# EAGLE design PCB Terminal Block & Connector (EAGLE 9.6.2)
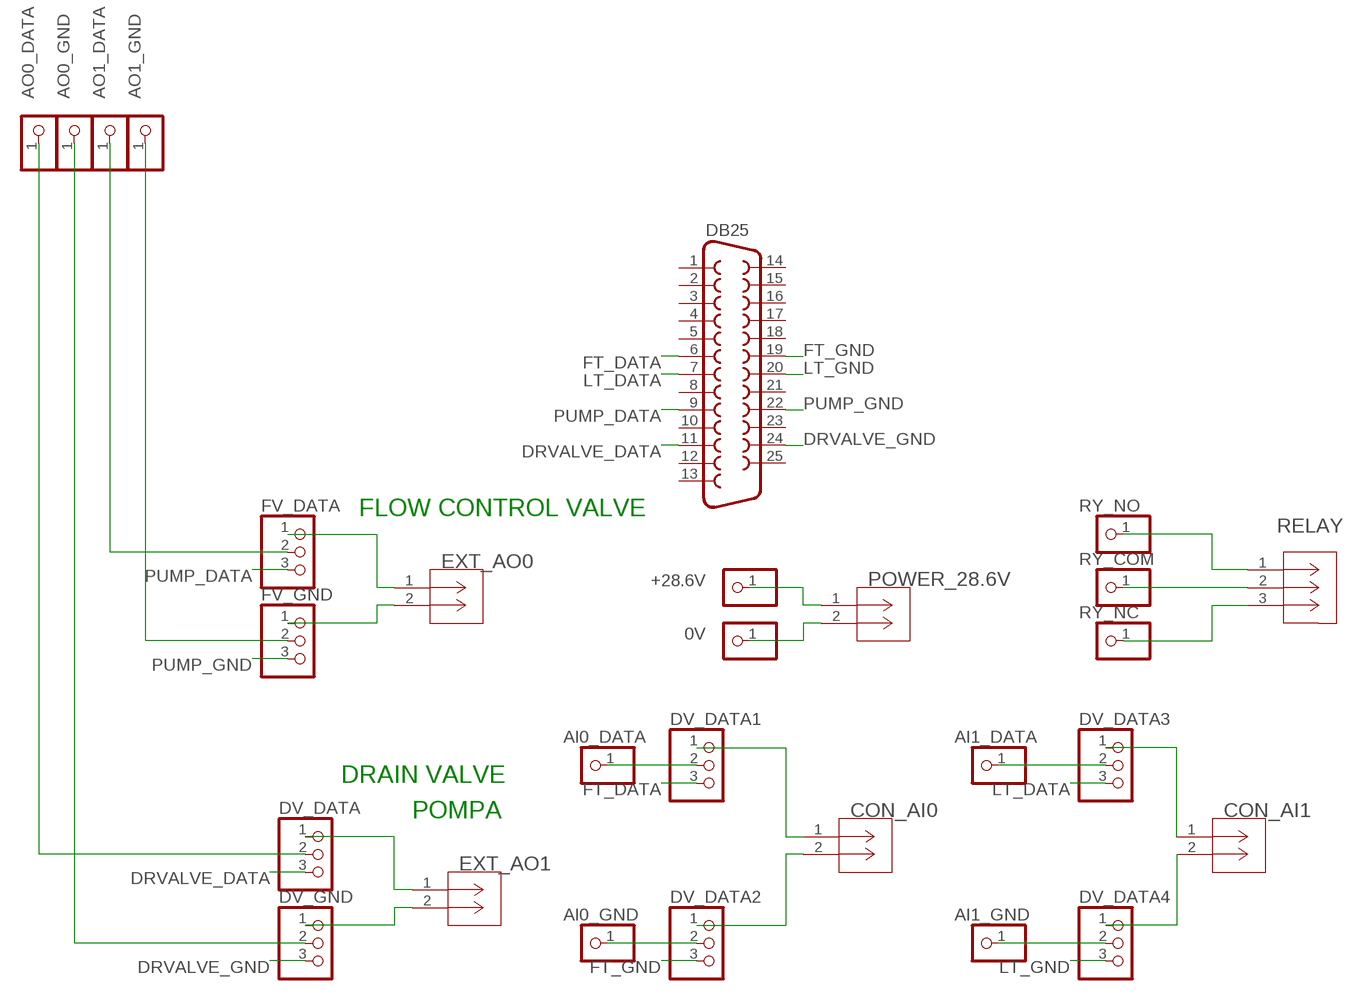
[diagram p0: schematic, sheet 1]

## Parts
0V  PINHD-1X1  [1X01]
+28.6V  PINHD-1X1  [1X01]
AI0_DATA  PINHD-1X1  [1X01]
AI0_GND  PINHD-1X1  [1X01]
AI1_DATA  PINHD-1X1  [1X01]
AI1_GND  PINHD-1X1  [1X01]
AO0_DATA  PINHD-1X1  [1X01]
AO0_GND  PINHD-1X1  [1X01]
AO1_DATA  PINHD-1X1  [1X01]
AO1_GND  PINHD-1X1  [1X01]
CON_AI0  KF8500-8.5-2P  [CONN_KF8500-8.5-2P_CKE]
CON_AI1  KF8500-8.5-2P  [CONN_KF8500-8.5-2P_CKE]
DB25  F25H  [F25H]
DV_DATA  PINHD-1X3  [1X03]
DV_DATA1  PINHD-1X3  [1X03]
DV_DATA2  PINHD-1X3  [1X03]
DV_DATA3  PINHD-1X3  [1X03]
DV_DATA4  PINHD-1X3  [1X03]
DV_GND  PINHD-1X3  [1X03]
EXT_AO0  KF8500-8.5-2P  [CONN_KF8500-8.5-2P_CKE]
EXT_AO1  KF8500-8.5-2P  [CONN_KF8500-8.5-2P_CKE]
FV_DATA  PINHD-1X3  [1X03]
FV_GND  PINHD-1X3  [1X03]
POWER_28.6V  KF8500-8.5-2P  [CONN_KF8500-8.5-2P_CKE]
RELAY  KF8500-8.5-4P  [CONN4_KF8500_1X4_1398X472_CKE]
RY_COM  PINHD-1X1  [1X01]
RY_NC  PINHD-1X1  [1X01]
RY_NO  PINHD-1X1  [1X01]

## Nets
AO0_DATA: AO0_DATA.1 DV_DATA.2
AO0_GND: AO0_GND.1 DV_GND.2
AO1_DATA: AO1_DATA.1 FV_DATA.2
AO1_GND: AO1_GND.1 FV_GND.2
DRVALVE_DATA: DB25.11 DV_DATA.3
DRVALVE_GND: DB25.24 DV_GND.3
EXT_AO2: DV_DATA.1 EXT_AO1.1
FT_DATA: DB25.6 DV_DATA1.3
FT_GND: DB25.19 DV_DATA2.3
LT_DATA: DB25.7 DV_DATA3.3
LT_GND: DB25.20 DV_DATA4.3
N$1: +28.6V.1 POWER_28.6V.1
N$2: 0V.1 POWER_28.6V.2
N$3: EXT_AO0.2 FV_GND.1
N$4: CON_AI0.1 DV_DATA1.1
N$5: CON_AI1.1 DV_DATA3.1
N$6: AI0_DATA.1 DV_DATA1.2
N$7: AI0_GND.1 DV_DATA2.2
N$8: CON_AI0.2 DV_DATA2.1
N$11: EXT_AO0.1 FV_DATA.1
N$12: CON_AI1.2 DV_DATA4.1
N$13: AI1_DATA.1 DV_DATA3.2
N$14: DV_GND.1 EXT_AO1.2
N$15: RELAY.2 RY_COM.1
N$16: AI1_GND.1 DV_DATA4.2
N$17: RELAY.3 RY_NC.1
N$18: RELAY.1 RY_NO.1
PUMP_DATA: DB25.9 FV_DATA.3
PUMP_GND: DB25.22 FV_GND.3
Unconnected: DB25.1 DB25.2 DB25.3 DB25.4 DB25.5 DB25.8 DB25.10 DB25.12 DB25.13 DB25.14 DB25.15 DB25.16 DB25.17 DB25.18 DB25.21 DB25.23 DB25.25

## Notes on the sheet
- FLOW CONTROL VALVE
- DRAIN VALVE
- POMPA

## Library data of the parts
0V +28.6V AI0_DATA AI0_GND AI1_DATA AI1_GND AO0_DATA AO0_GND AO1_DATA AO1_GND RY_COM RY_NC RY_NO = pinhead:PINHD-1X1: PIN HEADER
CON_AI0 CON_AI1 EXT_AO0 EXT_AO1 POWER_28.6V = KF8500:KF8500-8.5-2P; COPYRIGHT: Copyright (C) 2023 Ultra Librarian. All rights reserved.; MANUFACTURER_PART_NUMBER: KF8500-8.5-2P; MFR_NAME: CiXi KaiFeng Electronics
DB25 = con-subd:F25: SUB-D; OC_FARNELL: unknown; OC_NEWARK: unknown
DV_DATA DV_DATA1-DV_DATA4 DV_GND FV_DATA FV_GND = pinhead:PINHD-1X3: PIN HEADER
RELAY = KF8500_3P:KF8500-8.5-4P; COPYRIGHT: Copyright (C) 2023 Ultra Librarian. All rights reserved.; MANUFACTURER_PART_NUMBER: KF8500-8.5-4P; MFR_NAME: CiXi KaiFeng Electronics; TYPE: Barrier Blocks

## Board
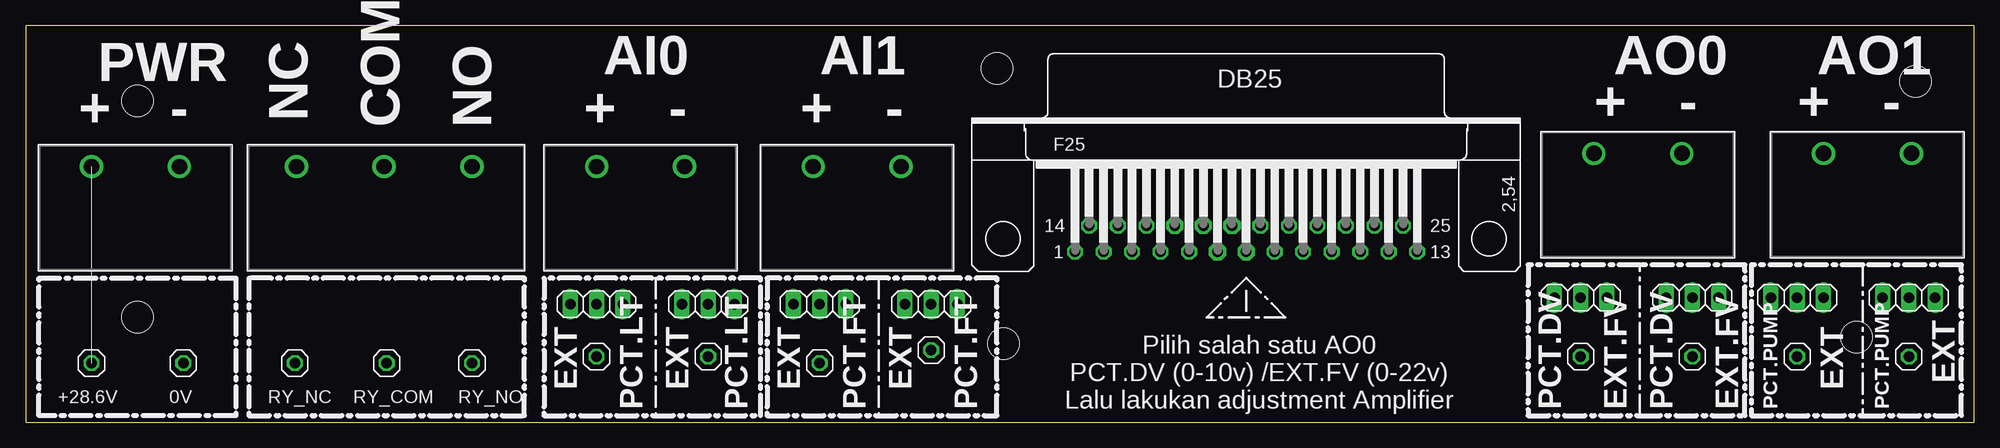
[diagram p1: board, top side]
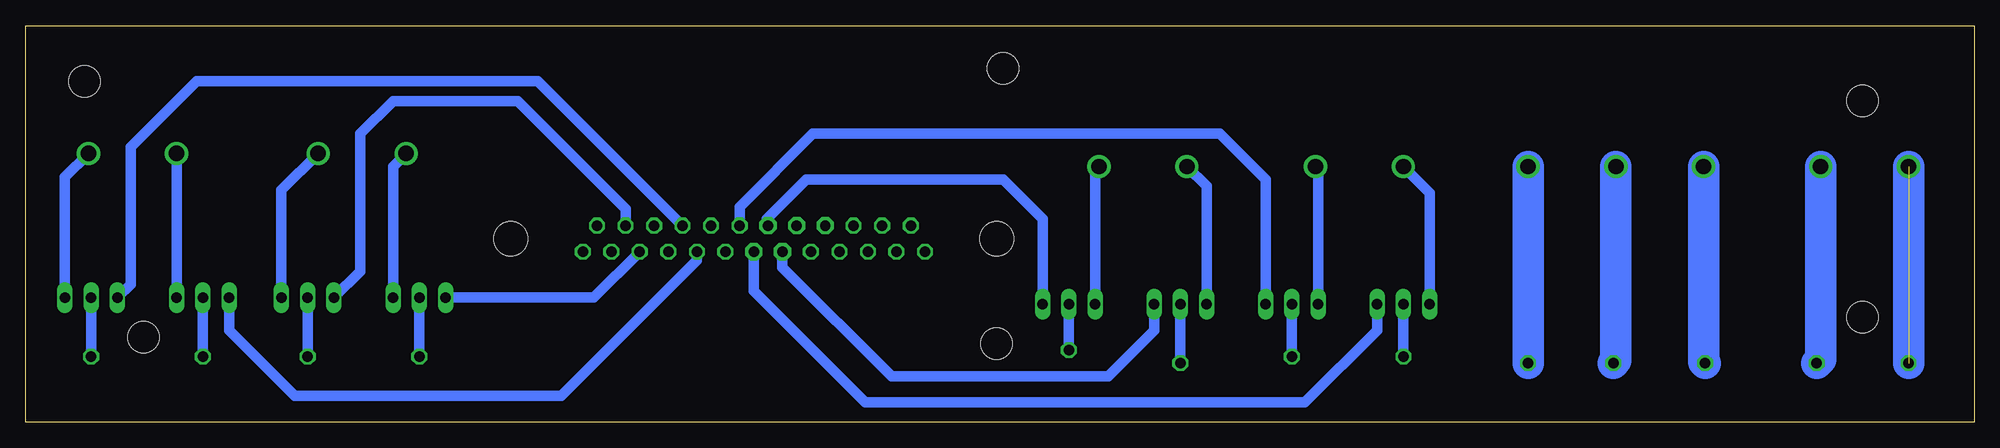
[diagram p2: board, bottom side, seen from below]

Size 188.57 x 38.41 mm. Coordinates in mm from the lower left corner, seen from the top.
Outline: 0,0 188.57,0 188.57,38.41 0,38.41 0,0
Copper layers (1*16): Top 0.035mm / dielectric 1.5mm / Bottom 0.035mm
Design rules "default": minimum track width 6mil, minimum drill 0.35mm, track to track 6mil, track to pad 6mil, pad to pad 6mil, via to via 6mil, smd to smd 6mil, copper to edge 40mil, drill to drill 6mil, minimum pad ring 10mil, minimum via ring 8mil, stop-mask expansion 4mil, vias tented up to drill 0mil, thermal gap 10mil
Holes 3.05 mm at 177.16,8.26 182.88,33.02 10.79,10.16 10.79,31.11 94.61,7.62 93.98,34.29

### Footprints (pad centres in the part's own frame; a part is rotated, then mirrored left to right if it is on the bottom)
1X01 = drill 1.016 octagon: 1 0,0
CONN_KF8500-8.5-2P_CKE = drill 1.499 pad 2.007: 1 0,0; 2 8.509,0
F25H = drill 1.016 octagon: 1 -16.561,-1.27; 2 -13.792,-1.27; 3 -11.049,-1.27; 4 -8.28,-1.27; 5 -5.512,-1.27; 8 2.769,-1.27; 9 5.512,-1.27; 10 8.28,-1.27; 11 11.049,-1.27; 12 13.792,-1.27; 13 16.561,-1.27; 14 -15.189,1.27; 15 -12.421,1.27; 16 -9.652,1.27; 20 1.372,1.27; 21 4.14,1.27; 22 6.909,1.27; 23 9.652,1.27; 24 12.421,1.27; 25 15.189,1.27 | drill 1.016 pad 1.67 octagon: 6 -2.769,-1.27; 7 0,-1.27; 17 -6.909,1.27; 18 -4.14,1.27; 19 -1.372,1.27 | hole 3.302: -23.52,0; 23.52,0
1X03 = drill 1.016 long: 1 -2.54,0; 2 0,0; 3 2.54,0
CONN4_KF8500_1X4_1398X472_CKE = drill 1.499 pad 2.007: 1 0,0; 2 -8.509,0; 3 -16.993,0

### Placement (x,y rotation side)
0V  15.24,5.71 0 top
+28.6V  6.35,5.71 0 top
AI0_DATA  76.83,5.71 0 top
AI0_GND  87.63,6.99 0 top
AI1_DATA  55.24,6.35 0 top
AI1_GND  66.04,6.35 0 top
AO0_DATA  150.5,6.35 0 top
AO0_GND  161.29,6.35 0 top
AO1_DATA  171.45,6.35 0 top
AO1_GND  182.25,6.35 0 top
CON_AI0  76.2,24.77 0 top
CON_AI1  55.24,24.77 0 top
DB25  118.11,17.78 0 top
DV_DATA  150.5,12.06 180 top
DV_DATA1  76.83,11.43 0 top
DV_DATA2  87.63,11.43 0 top
DV_DATA3  55.24,11.43 0 top
DV_DATA4  66.04,11.43 0 top
DV_GND  161.29,12.06 180 top
EXT_AO0  173.99,26.04 0 top
EXT_AO1  151.76,26.04 0 top
FV_DATA  171.45,12.06 180 top
FV_GND  182.25,12.06 180 top
POWER_28.6V  6.35,24.77 0 top
RELAY  43.18,24.77 0 top
RY_COM  34.92,5.71 270 top
RY_NC  26.04,5.71 270 top
RY_NO  43.18,5.71 270 top

### Tracks (layer width: path | path; a pad name or v marks a point on that pad's centre or on a via)
AO0_DATA
  Bottom 1.016: DV_DATA.2 AO0_DATA.1
AO0_GND
  Bottom 1.016: DV_GND.2 AO0_GND.1
AO1_DATA
  Bottom 1.016: FV_DATA.2 AO1_DATA.1
AO1_GND
  Bottom 1.016: FV_GND.2 AO1_GND.1
DRVALVE_DATA
  Bottom 1.016: DB25.11 133.6,12.06 DV_DATA.3
DRVALVE_GND
  Bottom 1.016: DB25.24 130.53,20.68 140.97,31.11 153.03,31.11 156.21,27.94 156.21,14.61 DV_GND.3
EXT_AO2
  Bottom 1.016: DV_DATA.1 153.03,24.77 EXT_AO1.1
FT_DATA
  Bottom 1.016: DB25.6 115.34,15.01 104.78,4.45 83.82,4.45 79.38,8.89 DV_DATA1.3
FT_GND
  Bottom 1.016: DB25.19 116.84,19.15 116.84,19.68 113.03,23.5 93.98,23.5 90.17,19.68 DV_DATA2.3
LT_DATA
  Bottom 1.016: DB25.7 118.11,12.7 107.31,1.91 64.77,1.91 57.78,8.89 DV_DATA3.3
LT_GND
  Bottom 1.016: DB25.20 119.48,20.85 112.39,27.94 73.03,27.94 68.58,23.5 DV_DATA4.3
N$1  (1 unrouted)
  Bottom 3.048: POWER_28.6V.1 +28.6V.1
N$2
  Bottom 3.048: 0V.1 14.86,6.1 POWER_28.6V.2
N$3
  Bottom 1.016: FV_GND.1 184.78,23.75 EXT_AO0.2
N$4
  Bottom 1.016: DV_DATA1.1 74.3,22.86 CON_AI0.1
N$5
  Bottom 1.016: DV_DATA3.1 52.7,22.23 CON_AI1.1
N$6
  Bottom 1.016: DV_DATA1.2 AI0_DATA.1
N$7
  Bottom 1.016: AI0_GND.1 DV_DATA2.2
N$8
  Bottom 1.016: DV_DATA2.1 85.09,24.38 CON_AI0.2
N$11
  Bottom 1.016: FV_DATA.1 EXT_AO0.1
N$12
  Bottom 1.016: DV_DATA4.1 63.5,24.51 CON_AI1.2
N$13
  Bottom 1.016: AI1_DATA.1 DV_DATA3.2
N$14
  Bottom 1.016: DV_GND.1 163.83,22.48 EXT_AO1.2
N$15
  Bottom 3.048: RELAY.2 34.67,5.97 RY_COM.1
N$16
  Bottom 1.016: DV_DATA4.2 AI1_GND.1
N$17
  Bottom 3.048: RELAY.3 26.19,5.87 RY_NC.1
N$18
  Bottom 3.048: RELAY.1 RY_NO.1
PUMP_DATA
  Bottom 1.016: DB25.9 123.62,15.66 136.74,2.54 162.56,2.54 168.91,8.89 FV_DATA.3
PUMP_GND
  Bottom 1.016: DB25.22 139.03,33.06 172.05,33.06 178.44,26.67 178.44,13.34 FV_GND.3

### Text on the board
tPlace: AI0 | AI1 | AO0 | AO1 | PWR | + | - | NC | COM | NO | + | - | + | - | + | - | + | - | EXT | EXT | EXT | EXT | EXT | EXT | PCT.LT | PCT.LT | PCT.FT | PCT.FT | PCT.DV | EXT.FV | PCT.DV | EXT.FV | PCT.PUMP | PCT.PUMP
tNames: Pilih salah satu AO0 / PCT.DV (0-10v) /EXT.FV (0-22v) / Lalu lakukan adjustment Amplifier